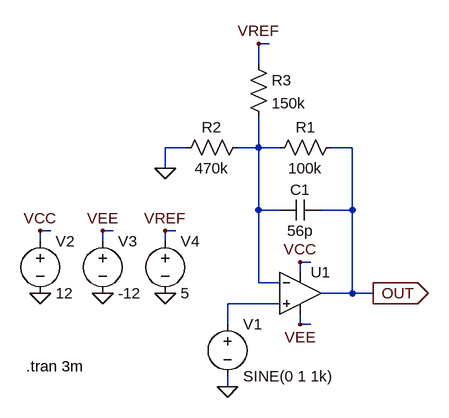
[diagram p0: schematic SAW_TRI_Amp.asc]
SAW_TRI_Amp.asc, the LTspice schematic file:
Version 4
SHEET 1 880 680
WIRE 192 -208 176 -208
WIRE 176 -176 176 -208
WIRE 64 -48 32 -48
WIRE 176 -48 176 -96
WIRE 176 -48 144 -48
WIRE 208 -48 176 -48
WIRE 320 -48 288 -48
WIRE 32 -16 32 -48
WIRE 176 48 176 -48
WIRE 208 48 176 48
WIRE 320 48 320 -48
WIRE 320 48 272 48
WIRE -144 80 -160 80
WIRE -48 80 -64 80
WIRE 48 80 32 80
WIRE -160 96 -160 80
WIRE -64 96 -64 80
WIRE 32 96 32 80
WIRE 256 128 240 128
WIRE 240 144 240 128
WIRE 176 160 176 48
WIRE 208 160 176 160
WIRE 320 176 320 48
WIRE 320 176 272 176
WIRE 352 176 320 176
WIRE 208 192 128 192
WIRE 128 224 128 192
WIRE 240 224 240 208
WIRE 256 224 240 224
WIRE 128 320 128 304
FLAG 240 128 VCC
FLAG 240 224 VEE
FLAG 32 -16 0
FLAG 176 -208 VREF
FLAG 128 320 0
FLAG 352 176 OUT
IOPIN 352 176 Out
FLAG -160 176 0
FLAG -64 176 0
FLAG 32 176 0
FLAG -160 80 VCC
FLAG -64 80 VEE
FLAG 32 80 VREF
SYMBOL Opamps\\UniversalOpamp2 240 176 R0
SYMATTR InstName U1
SYMBOL res 304 -64 R90
WINDOW 0 0 56 VBottom 2
WINDOW 3 32 56 VTop 2
SYMATTR InstName R1
SYMATTR Value 100k
SYMBOL cap 272 32 R90
WINDOW 0 0 32 VBottom 2
WINDOW 3 32 32 VTop 2
SYMATTR InstName C1
SYMATTR Value 56p
SYMBOL res 160 -64 R90
WINDOW 0 0 56 VBottom 2
WINDOW 3 32 56 VTop 2
SYMATTR InstName R2
SYMATTR Value 470k
SYMBOL res 160 -192 R0
SYMATTR InstName R3
SYMATTR Value 150k
SYMBOL voltage 128 208 R0
WINDOW 123 0 0 Left 0
WINDOW 39 0 0 Left 0
SYMATTR InstName V1
SYMATTR Value SINE(0 1 1k)
SYMBOL voltage -160 80 R0
WINDOW 123 0 0 Left 0
WINDOW 39 0 0 Left 0
SYMATTR InstName V2
SYMATTR Value 12
SYMBOL voltage -64 80 R0
WINDOW 123 0 0 Left 0
WINDOW 39 0 0 Left 0
SYMATTR InstName V3
SYMATTR Value -12
SYMBOL voltage 32 80 R0
WINDOW 123 0 0 Left 0
WINDOW 39 0 0 Left 0
SYMATTR InstName V4
SYMATTR Value 5
TEXT -182 288 Left 2 !.tran 3m

The netlist it stands for:
* SAW_TRI_Amp.asc
XU1 N002 N001 VCC VEE OUT level.2 Avol=1Meg GBW=10Meg Slew=10Meg ilimit=25m rail=0 Vos=0 phimargin=45 en=0 enk=0 in=0 ink=0 Rin=500Meg  ; pins IN+ IN- V+ V- OUT
R1 OUT N001 100k
C1 OUT N001 56p
R2 N001 0 470k
R3 VREF N001 150k
V1 N002 0 SINE(0 1 1k)
V2 VCC 0 12
V3 VEE 0 -12
V4 VREF 0 5
.tran 3m
.lib UniversalOpamps2.sub
.backanno
.end